# Altium schematic sheet Power.SchDoc
size A4
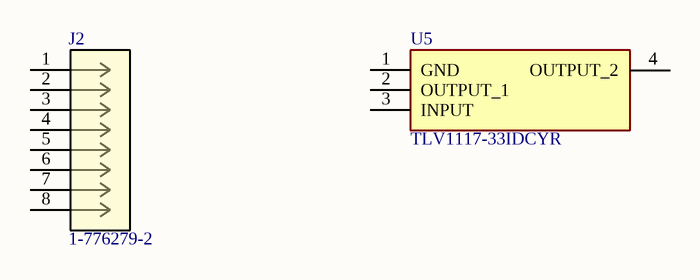
[diagram p0: Power.SchDoc]

## Parts
J2  1-776279-2  [CONN8_776279_TEC]
U5  TLV1117-33IDCYR  [SOT230P700X180-4N]

## Nets

Not connected (* = marked no-connect by the designer): J2 1 2 3 4 5 6 7 8; U5 1(GND) 2(OUTPUT_1) 3(INPUT) 4(OUTPUT_2)

## Library data of the parts
J2 = 1-776279-2: 8 POS RIGHT ANGLE HEADER ASSY; Vendor: TE Connectivity; ROWS/CONFIG: 3; PITCH(MM): 0.157; POSITIONS: 8; Built_By: EMA_UL_Team; SourceLibrary: TE_Connectivity-2018-03-16; Copyright: Copyright (C) 2016 Accelerated Designs. All rights reserved; Manufacturer_Part_Number: 1-776279-2; TE_Part_Number: 1-776279-2; PRODUCT: -; Type: DEV; RefDes: RefDes
U5 = TLV1117-33IDCYR: Integrated Circuit; Manufacturer_Name: Texas Instruments; Datasheet Link: http://www.ti.com/lit/ds/symlink/tlv1117.pdf?HQS=TI-null-null-digikeymode-df-pf-null-wwe&ts=1590668900314; Height: 1.8mm; Manufacturer_Part_Number: TLV1117-33IDCYR; Arrow Part Number: TLV1117-33IDCYR; Arrow Price/Stock: https://www.arrow.com/en/products/tlv1117-33idcyr/texas-instruments; Mouser Part Number: 595-TLV1117-33IDCYR; Mouser Price/Stock: https://www.mouser.co.uk/ProductDetail/Texas-Instruments/TLV1117-33IDCYR?qs=p6lVfQR1GSoKgp3tAXcW5w%3D%3D